# Altium project StuderA80ReproExtend_V0.2_RCA.PrjPcb
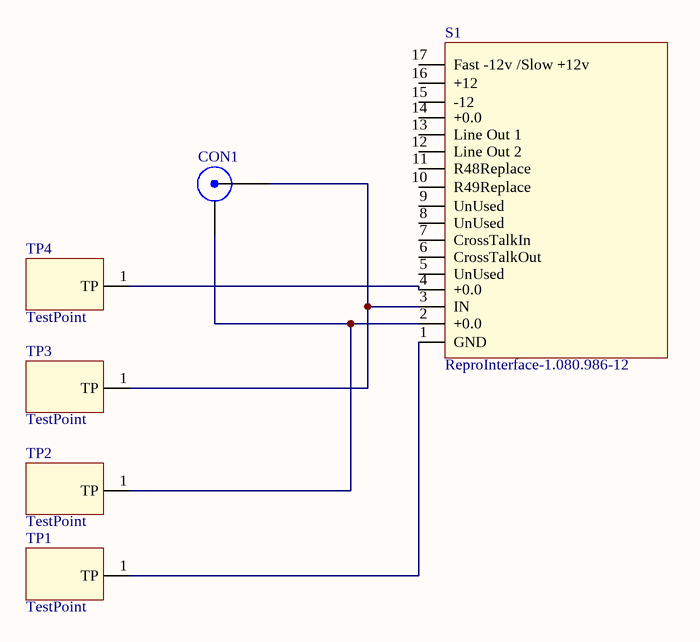
[diagram p0: StuderA80ReproExtend_V0.2_RCA.SchDoc]
1 sheet, 6 parts. Net scope: global (net labels, ports and power ports of the same name join across sheets).
Board file: StuderA80ReproExtend_V0.2_RCA.PcbDoc

## Sheet StuderA80ReproExtend_V0.2_RCA.SchDoc
size A4

### Parts
CON1  RCA  [RCA-RJ255]  (value not drawn)
S1  ReproInterface-1.080.986-12  [ReproInterface]
TP1  TestPoint  [TP-1.0mm]
TP2  TestPoint  [TP-1.0mm]
TP3  TestPoint  [TP-1.0mm]
TP4  TestPoint  [TP-1.0mm]

### Nets
NetCON1_1: CON1.1(X) S1.3(IN) TP3.1(TP)
NetCON1_2: CON1.2(Y) S1.2(+0.0) TP2.1(TP)
NetS1_1: S1.1(GND) TP1.1(TP)
NetS1_4: S1.4(+0.0) TP4.1(TP)

Not connected (* = marked no-connect by the designer): S1 5(UnUsed) 6(CrossTalkOut) 7(CrossTalkIn) 8(UnUsed) 9(UnUsed) 10(R49Replace) 11(R48Replace) 12(Line_Out_2) 13(Line_Out_1) 14(+0.0) 15(-12) 16(+12) 17(Fast_-12v_/Slow_+12v)

### Library data of the parts
CON1 = RCA: RCA Connector; Revision: 17-Jul-2002: Re-released for DXP Platform.; Publisher: Altium Limited
S1 = ReproInterface-1.080.986-12: Studer A80 RC Reproduce Card 1.080.986-12 Interface